# Altium schematic sheet BBB-Supply.SchDoc
size Tabloid
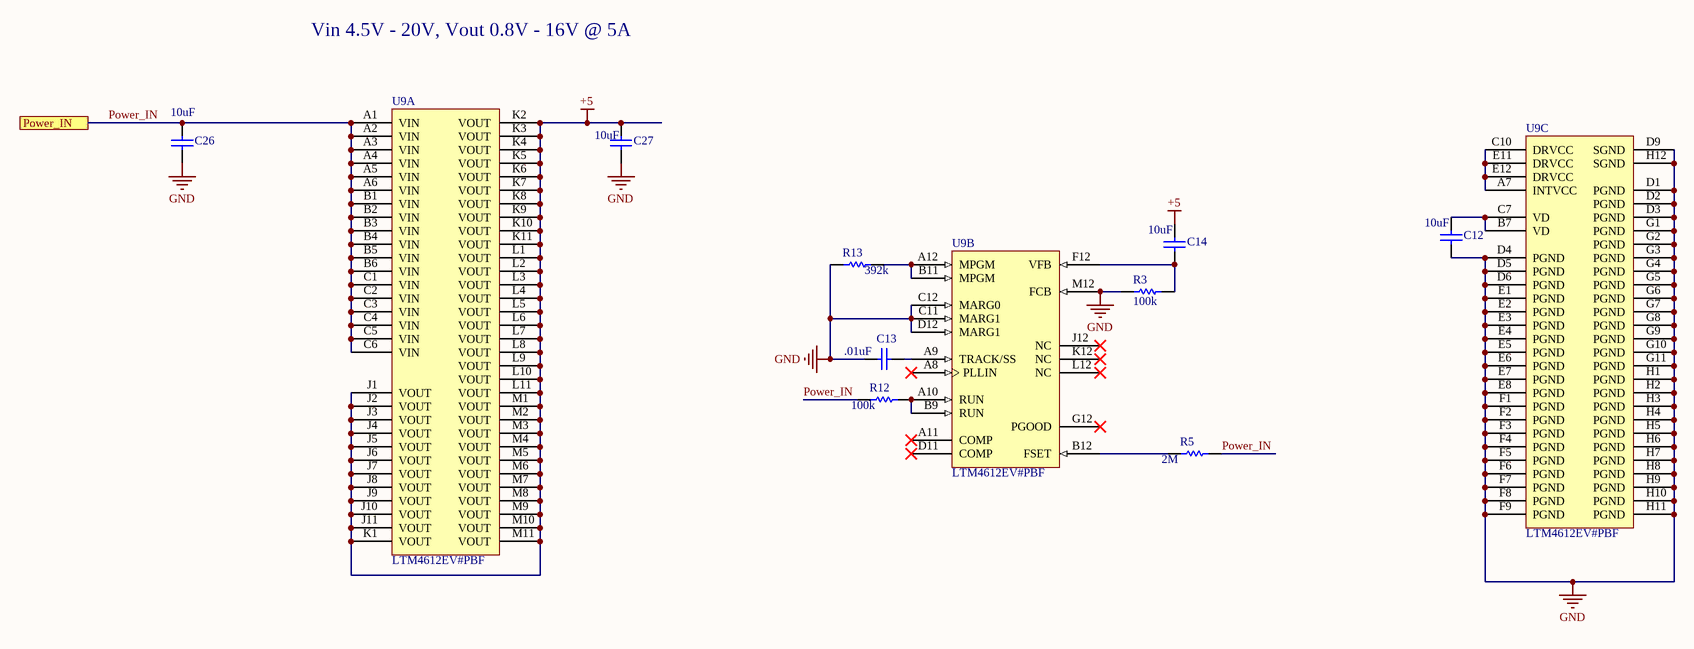
[diagram p0: BBB-Supply.SchDoc]

## Parts
C12  10uF  [CAPC0805(2012)145_N]
C13  .01uF  [CAPC0805(2012)145_N]
C14  10uF  [CAPC0805(2012)145_N]
C26  10uF  [CAPC0805(2012)145_N]
C27  10uF  [CAPC0805(2012)145_N]
R3  100k  [RESC0805(2012)_M]
R5  2M  [RESC0805(2012)_M]
R12  100k  [RESC0805(2012)_M]
R13  392k  [RESC0805(2012)_M]
U9  LTM4612EV#PBF  [LT-LGA-133-05-08-1766_V]  (parts A,B,C of 3)

## Ports
Power_IN

## Nets
+5: C14.1 C27.1 U9.J1(VOUT) U9.J2(VOUT) U9.J3(VOUT) U9.J4(VOUT) U9.J5(VOUT) U9.J6(VOUT) U9.J7(VOUT) U9.J8(VOUT) U9.J9(VOUT) U9.J10(VOUT) U9.J11(VOUT) U9.K1(VOUT) U9.K2(VOUT) U9.K3(VOUT) U9.K4(VOUT) U9.K5(VOUT) U9.K6(VOUT) U9.K7(VOUT) U9.K8(VOUT) U9.K9(VOUT) U9.K10(VOUT) U9.K11(VOUT) U9.L1(VOUT) U9.L2(VOUT) U9.L3(VOUT) U9.L4(VOUT) U9.L5(VOUT) U9.L6(VOUT) U9.L7(VOUT) U9.L8(VOUT) U9.L9(VOUT) U9.L10(VOUT) U9.L11(VOUT) U9.M1(VOUT) U9.M2(VOUT) U9.M3(VOUT) U9.M4(VOUT) U9.M5(VOUT) U9.M6(VOUT) U9.M7(VOUT) U9.M8(VOUT) U9.M9(VOUT) U9.M10(VOUT) U9.M11(VOUT)
GND: C12.2 C13.1 C26.2 C27.2 R3.1 R13.2 U9.C11(MARG1) U9.C12(MARG0) U9.D1(PGND) U9.D2(PGND) U9.D3(PGND) U9.D4(PGND) U9.D5(PGND) U9.D6(PGND) U9.D9(SGND) U9.D12(MARG1) U9.E1(PGND) U9.E2(PGND) U9.E3(PGND) U9.E4(PGND) U9.E5(PGND) U9.E6(PGND) U9.E7(PGND) U9.E8(PGND) U9.F1(PGND) U9.F2(PGND) U9.F3(PGND) U9.F4(PGND) U9.F5(PGND) U9.F6(PGND) U9.F7(PGND) U9.F8(PGND) U9.F9(PGND) U9.G1(PGND) U9.G2(PGND) U9.G3(PGND) U9.G4(PGND) U9.G5(PGND) U9.G6(PGND) U9.G7(PGND) U9.G8(PGND) U9.G9(PGND) U9.G10(PGND) U9.G11(PGND) U9.H1(PGND) U9.H2(PGND) U9.H3(PGND) U9.H4(PGND) U9.H5(PGND) U9.H6(PGND) U9.H7(PGND) U9.H8(PGND) U9.H9(PGND) U9.H10(PGND) U9.H11(PGND) U9.H12(SGND) U9.M12(FCB)
Power_IN: C26.1 R5.1 R12.2 U9.A1(VIN) U9.A2(VIN) U9.A3(VIN) U9.A4(VIN) U9.A5(VIN) U9.A6(VIN) U9.B1(VIN) U9.B2(VIN) U9.B3(VIN) U9.B4(VIN) U9.B5(VIN) U9.B6(VIN) U9.C1(VIN) U9.C2(VIN) U9.C3(VIN) U9.C4(VIN) U9.C5(VIN) U9.C6(VIN) ; port Power_IN
NetC12_1: C12.1 U9.B7(VD) U9.C7(VD)
NetC13_2: C13.2 U9.A9(TRACK/SS)
NetC14_2: C14.2 R3.2 U9.F12(VFB)
NetR5_2: R5.2 U9.B12(FSET)
NetR12_1: R12.1 U9.A10(RUN) U9.B9(RUN)
NetR13_1: R13.1 U9.A12(MPGM) U9.B11(MPGM)
NetU9_A7: U9.A7(INTVCC) U9.C10(DRVCC) U9.E11(DRVCC) U9.E12(DRVCC)

Not connected (* = marked no-connect by the designer): U9 A8(PLLIN)* A11(COMP)* D11(COMP)* G12(PGOOD)* J12(NC)* K12(NC)* L12(NC)*

## Notes on the sheet
- Vin 4.5V - 20V, Vout 0.8V - 16V @ 5A
- Title
- Size:
- Date:
- Tabloid
- Number:
- Time:
- Revision:
- Sheet
- of
- ZLS Corporation
- 7801 North Lamar Blvd.
- Suite E-184
- Austin, Texas 78752  USA
- (512) 453-0288
- File:

## Library data of the parts
C12 C14 C26 C27 = CMP-1036-04795-1: CAP CER 10UF 25V X7R 0805; Manufacturer: TDK; Manufacturer Part Number: C2012X5R1V106K125AC; Tolerance: 10 %; Type: Commercial Grade MLCC; Voltage Rating DC: 35 VDC; Class: Class 2; Dielectric: X5R; Supplier 1: Mouser; Supplier Part Number 1: 810-C2012X5R1V106K1C; RoHS: RoHS Compliant; Category: Multilayer Ceramic Capacitors MLCC - SMD/SMT; Stock 1: 33130; Pricing 1: 1=0.920, 10=0.648, 100=0.426, 500=0.316, 1000=0.268, 2000=0.220 (USD); Capacitance: 10 uF; Height: 1.25 mm; Length: 2 mm; Package / Case: 0805 (2012 metric); Packaging: Cut Tape; Product: General Type MLCCs; Series: C; Termination Style: SMD/SMT; Width: 1.25 mm; Brand: TDK; Case Code - in: 0805; Case Code - mm: 2012; Maximum Operating Temperature: + 85 C; Minimum Operating Temperature: - 55 C; Product Type: Ceramic Capacitors; Standard Pack Qty: 2000; Subcategory: Capacitors; RoHS - Mouser: Y; Minimum Order Quantity: 1; Reeling: True; ComponentLink1URL: https://www.mouser.com/datasheet/2/400/lcc_commercial_general_en-837201.pdf; ComponentLink1Description: https://www.mouser.com/datasheet/2/400/lcc_commercial_general_en-837201.pdf
C13 = CMP-1036-04795-1: Manufacturer: Yageo; Manufacturer Part Number: AC0805KRX7R7BB103; Tolerance: ±10%; Voltage - Rated: 16V; Temperature Coefficient: X7R; Supplier 1: Digi-Key; Supplier Part Number 1: 311-3161-6-ND; RoHS: RoHS Compliant; Category: Capacitors; Stock 1: 311; Pricing 1: 1=0.22, 10=0.158, 100=0.0745, 500=0.05224, 1000=0.04324 (USD); Packaging: Digi-Reel®; Part Status: Active; Operating Temperature: -55°C ~ 125°C; Features: -; Ratings: AEC-Q200; Applications: Automotive; Failure Rate: -; Mounting Type: Surface Mount, MLCC; Package / Case: 0805 (2012 Metric); Size / Dimension: 0.079" L x 0.049" W (2.00mm x 1.25mm); Height - Seated (Max): -; Thickness (Max): 0.037" (0.95mm); Lead Spacing: -; Lead Style: -; ComponentLink1URL: http://www.yageo.com/NewPortal/_en/search/productDocs.jsp?YageoPartNumber=AC0805KRX7R7BB103; ComponentLink1Description: http://www.yageo.com/NewPortal/_en/search/productDocs.jsp?YageoPartNumber=AC0805KRX7R7BB103
R3 R5 R12 R13 = CMP-1013-00017-1: RES SMD 0.8 OHM 1% 1/8W 0805; ComponentLink1URL: https://www.mouser.com/datasheet/2/219/TLRH-2321.pdf; ComponentLink1Description: https://www.mouser.com/datasheet/2/219/TLRH-2321.pdf
U9 = CMP-0483-00080-1: EN55022B Compliant 36 VIN, 15 VOUT, 5 A, DC/DC uModule Regulator, 133-pin LGA, -40 to 125 degC, Pb-Free, Tray; Manufacturer: Linear Technology; Isupply(mA): 4.5; Tracking: yes; Frequency(kHz): 940; Frequency Sync Range: 200kHz - 1.3MHz; Vin Min(V): 5; Switch Current(A): 9; Vout Min(V): 3.3; Vout Max(V): 15; Number of Outputs: 1; Extended Temp: E, I, MP; Vin Max(V): 36; Ishutdown(uA): 50; Topology: Buck; Packing: Tray; PackageReference: LGA-133; ComponentLink3URL: http://cds.linear.com/docs/en/packaging/05081766_A_lga133.pdf; Code_JEDEC: MO-222; DatasheetVersion: Rev. B; PartNumber: LTM4612EV#PBF; Synchronous: yes; RoHS: TRUE; Mounting Technology: Surface Mount; ComponentLink1URL: http://www.linear.com/; ComponentLink2URL: http://cds.linear.com/docs/en/datasheet/4612fb.pdf; ComponentLink1Description: Manufacturer URL; PackageDescription: 133-Pin LGA, Body 15 x 15 mm, Pitch 1.27 mm; ComponentLink3Description: Package Specification; PackageVersion: Rev. A, 02/2013; ComponentLink2Description: Datasheet; Output Current(A): 5; PartId: 1